# Altium schematic sheet Board.SchDoc
size 558 x 431 mm; SheetNumber: 1; SheetTotal: 3
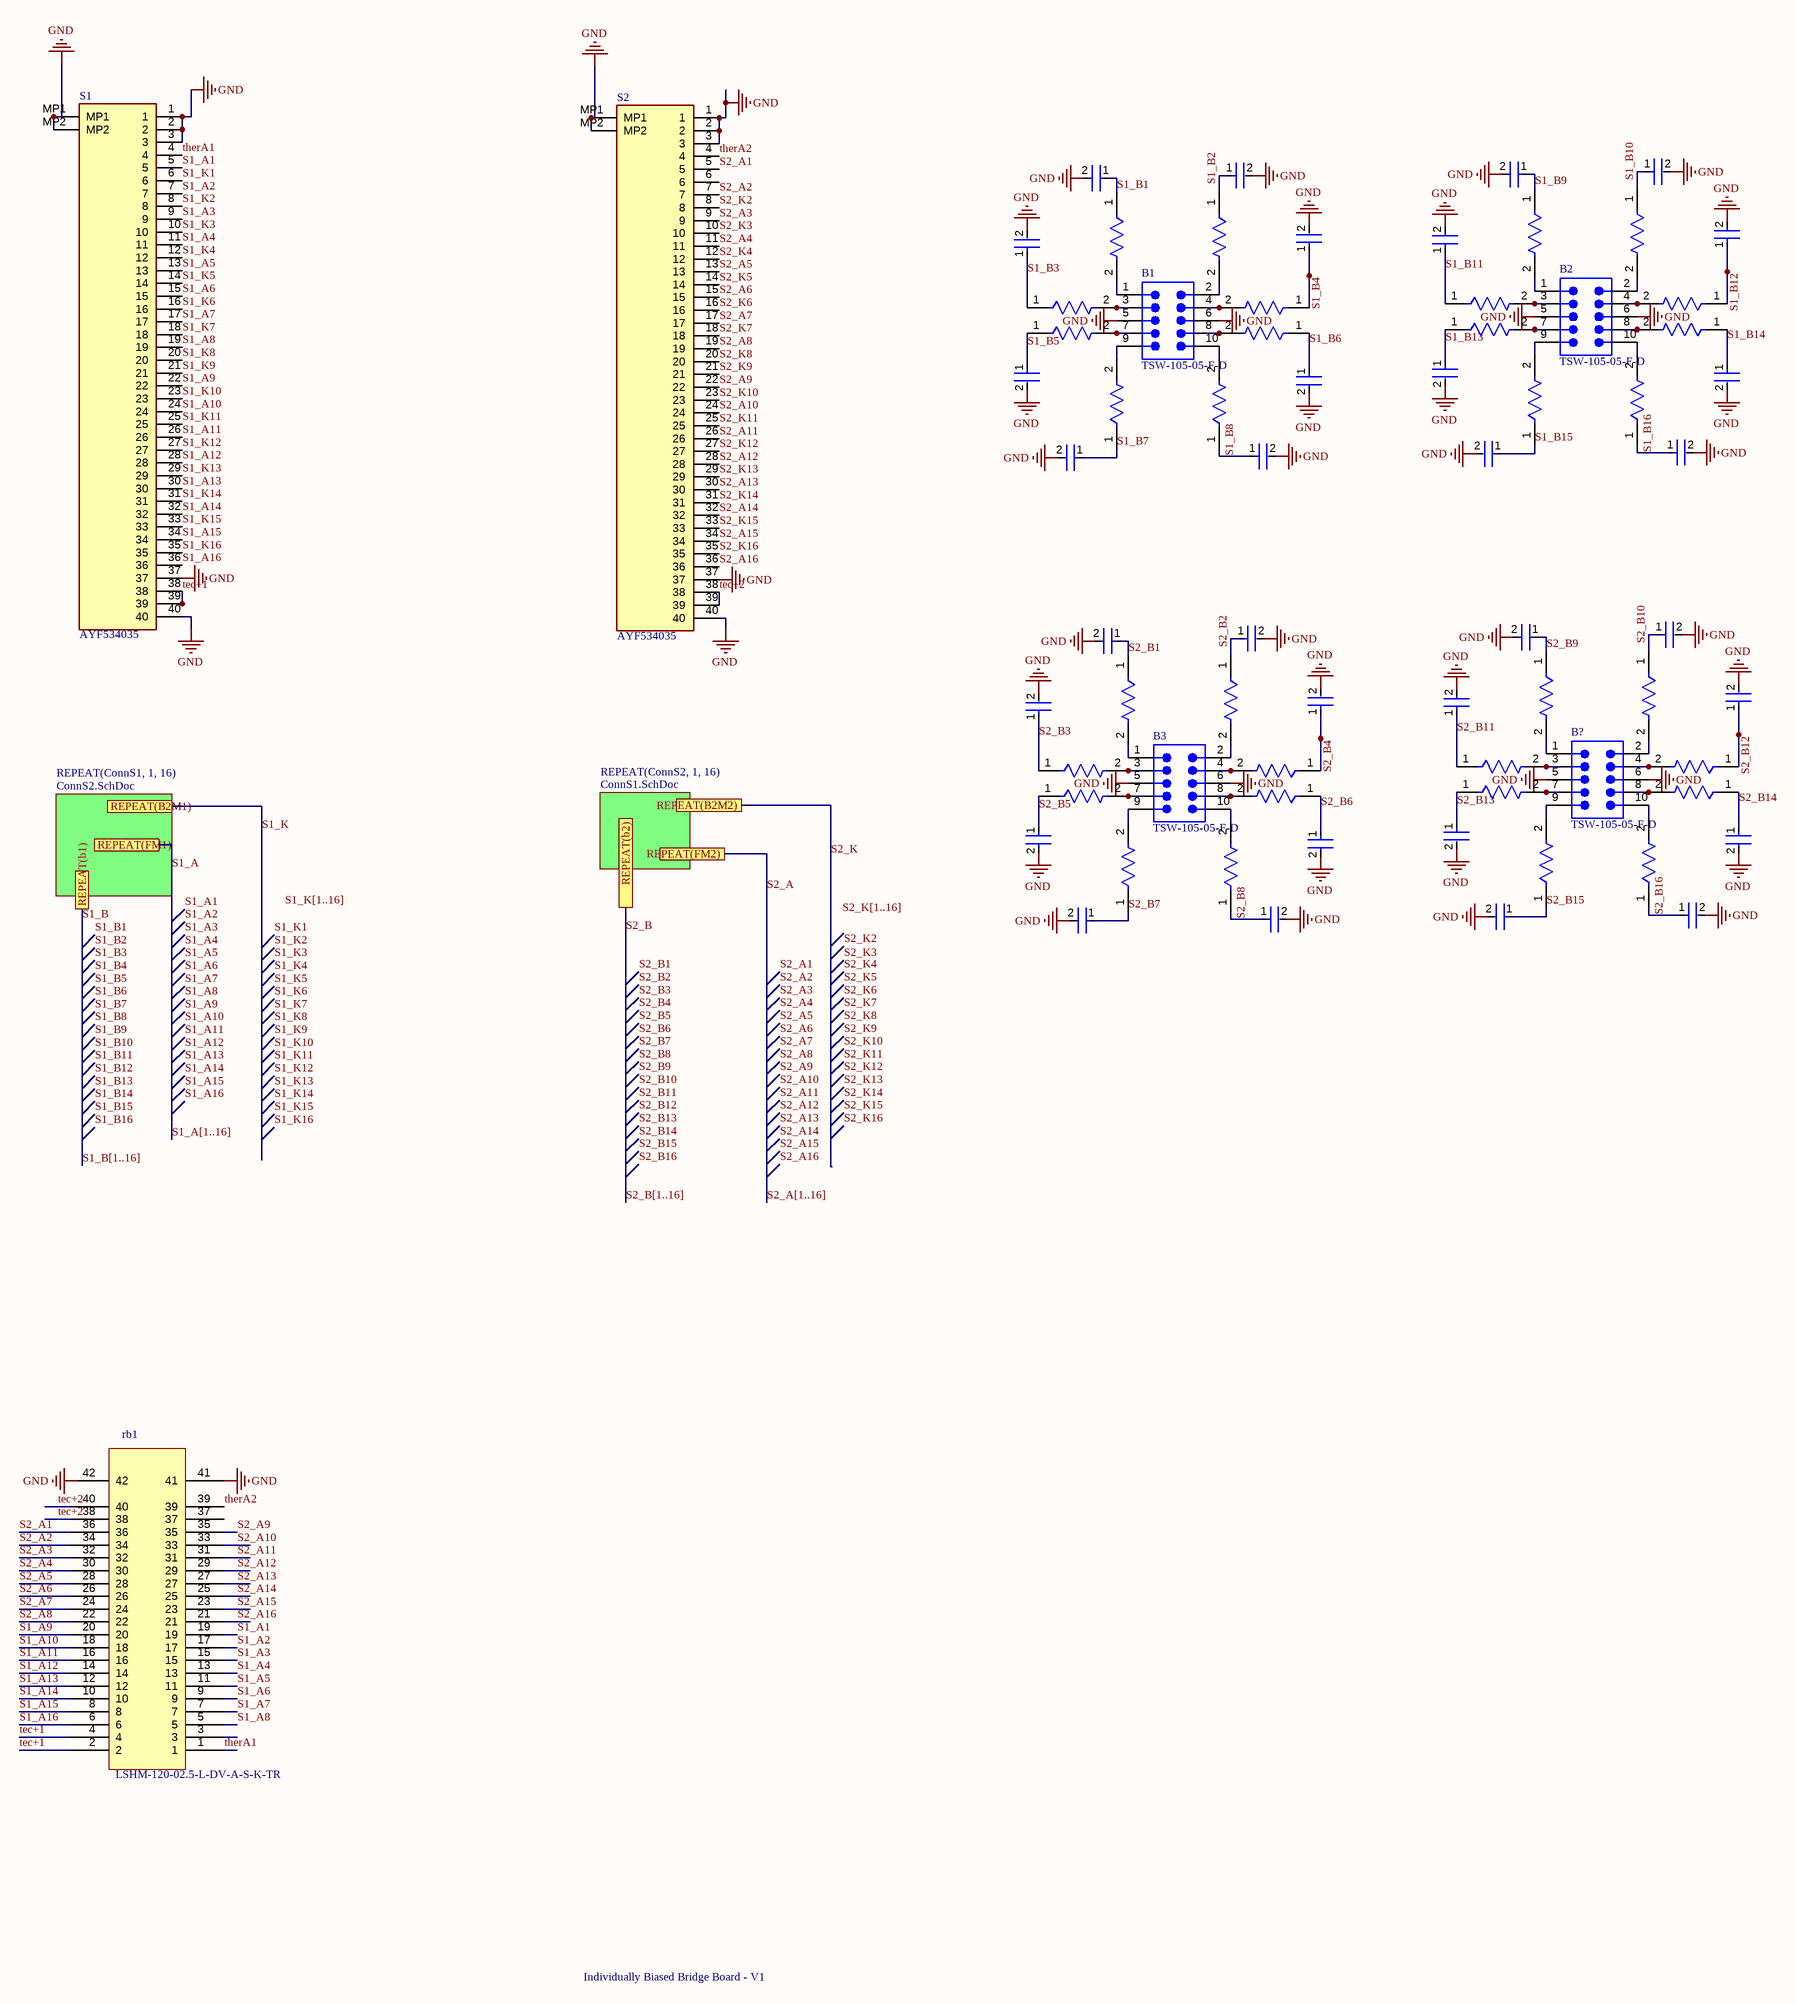
[diagram p0: Board.SchDoc]

## Parts
B1  TSW-105-05-F-D  [SMTC-TSW-105-05-X-D]
B2  TSW-105-05-F-D  [SMTC-TSW-105-05-X-D]
B3  TSW-105-05-F-D  [SMTC-TSW-105-05-X-D]
B?  TSW-105-05-F-D  [SMTC-TSW-105-05-X-D]
CT1  C0603C104K4RACTU  [FP-C0603C-CF-MFG]  (value not drawn)
CT2  C0603C104K4RACTU  [FP-C0603C-CF-MFG]  (value not drawn)
CT3  C0603C104K4RACTU  [FP-C0603C-CF-MFG]  (value not drawn)
CT4  C0603C104K4RACTU  [FP-C0603C-CF-MFG]  (value not drawn)
CT5  C0603C104K4RACTU  [FP-C0603C-CF-MFG]  (value not drawn)
CT6  C0603C104K4RACTU  [FP-C0603C-CF-MFG]  (value not drawn)
CT7  C0603C104K4RACTU  [FP-C0603C-CF-MFG]  (value not drawn)
CT8  C0603C104K4RACTU  [FP-C0603C-CF-MFG]  (value not drawn)
CT9  C0603C104K4RACTU  [FP-C0603C-CF-MFG]  (value not drawn)
CT10  C0603C104K4RACTU  [FP-C0603C-CF-MFG]  (value not drawn)
CT11  C0603C104K4RACTU  [FP-C0603C-CF-MFG]  (value not drawn)
CT12  C0603C104K4RACTU  [FP-C0603C-CF-MFG]  (value not drawn)
CT13  C0603C104K4RACTU  [FP-C0603C-CF-MFG]  (value not drawn)
CT14  C0603C104K4RACTU  [FP-C0603C-CF-MFG]  (value not drawn)
CT15  C0603C104K4RACTU  [FP-C0603C-CF-MFG]  (value not drawn)
CT16  C0603C104K4RACTU  [FP-C0603C-CF-MFG]  (value not drawn)
CT17  C0603C104K4RACTU  [FP-C0603C-CF-MFG]  (value not drawn)
CT18  C0603C104K4RACTU  [FP-C0603C-CF-MFG]  (value not drawn)
CT20  C0603C104K4RACTU  [FP-C0603C-CF-MFG]  (value not drawn)
CT21  C0603C104K4RACTU  [FP-C0603C-CF-MFG]  (value not drawn)
CT22  C0603C104K4RACTU  [FP-C0603C-CF-MFG]  (value not drawn)
CT23  C0603C104K4RACTU  [FP-C0603C-CF-MFG]  (value not drawn)
CT24  C0603C104K4RACTU  [FP-C0603C-CF-MFG]  (value not drawn)
CT25  C0603C104K4RACTU  [FP-C0603C-CF-MFG]  (value not drawn)
CT26  C0603C104K4RACTU  [FP-C0603C-CF-MFG]  (value not drawn)
CT27  C0603C104K4RACTU  [FP-C0603C-CF-MFG]  (value not drawn)
CT28  C0603C104K4RACTU  [FP-C0603C-CF-MFG]  (value not drawn)
CT29  C0603C104K4RACTU  [FP-C0603C-CF-MFG]  (value not drawn)
CT30  C0603C104K4RACTU  [FP-C0603C-CF-MFG]  (value not drawn)
CT31  C0603C104K4RACTU  [FP-C0603C-CF-MFG]  (value not drawn)
CT32  C0603C104K4RACTU  [FP-C0603C-CF-MFG]  (value not drawn)
CT33  C0603C104K4RACTU  [FP-C0603C-CF-MFG]  (value not drawn)
rb1  LSHM-120-02.5-L-DV-A-S-K-TR  [LSHM-120-02.5-L-DV-A-S-K-TR]
RP1  CR0402-FX-102GLF  [FP-CR0402-IPC_C]  (value not drawn)
RP2  CR0402-FX-102GLF  [FP-CR0402-IPC_C]  (value not drawn)
RP3  CR0402-FX-102GLF  [FP-CR0402-IPC_C]  (value not drawn)
RP4  CR0402-FX-102GLF  [FP-CR0402-IPC_C]  (value not drawn)
RP6  CR0402-FX-102GLF  [FP-CR0402-IPC_C]  (value not drawn)
RP7  CR0402-FX-102GLF  [FP-CR0402-IPC_C]  (value not drawn)
RP8  CR0402-FX-102GLF  [FP-CR0402-IPC_C]  (value not drawn)
RP9  CR0402-FX-102GLF  [FP-CR0402-IPC_C]  (value not drawn)
RS9  CR0402-FX-102GLF  [FP-CR0402-IPC_C]  (value not drawn)
RS10  CR0402-FX-102GLF  [FP-CR0402-IPC_C]  (value not drawn)
RS11  CR0402-FX-102GLF  [FP-CR0402-IPC_C]  (value not drawn)
RS12  CR0402-FX-102GLF  [FP-CR0402-IPC_C]  (value not drawn)
RS13  CR0402-FX-102GLF  [FP-CR0402-IPC_C]  (value not drawn)
RS14  CR0402-FX-102GLF  [FP-CR0402-IPC_C]  (value not drawn)
RS15  CR0402-FX-102GLF  [FP-CR0402-IPC_C]  (value not drawn)
RS16  CR0402-FX-102GLF  [FP-CR0402-IPC_C]  (value not drawn)
RS17  CR0402-FX-102GLF  [FP-CR0402-IPC_C]  (value not drawn)
RS18  CR0402-FX-102GLF  [FP-CR0402-IPC_C]  (value not drawn)
RS19  CR0402-FX-102GLF  [FP-CR0402-IPC_C]  (value not drawn)
RS20  CR0402-FX-102GLF  [FP-CR0402-IPC_C]  (value not drawn)
RS21  CR0402-FX-102GLF  [FP-CR0402-IPC_C]  (value not drawn)
RS22  CR0402-FX-102GLF  [FP-CR0402-IPC_C]  (value not drawn)
RS23  CR0402-FX-102GLF  [FP-CR0402-IPC_C]  (value not drawn)
RS24  CR0402-FX-102GLF  [FP-CR0402-IPC_C]  (value not drawn)
RS25  CR0402-FX-102GLF  [FP-CR0402-IPC_C]  (value not drawn)
RS26  CR0402-FX-102GLF  [FP-CR0402-IPC_C]  (value not drawn)
RS27  CR0402-FX-102GLF  [FP-CR0402-IPC_C]  (value not drawn)
RS28  CR0402-FX-102GLF  [FP-CR0402-IPC_C]  (value not drawn)
RS29  CR0402-FX-102GLF  [FP-CR0402-IPC_C]  (value not drawn)
RS30  CR0402-FX-102GLF  [FP-CR0402-IPC_C]  (value not drawn)
RS31  CR0402-FX-102GLF  [FP-CR0402-IPC_C]  (value not drawn)
RS35  CR0402-FX-102GLF  [FP-CR0402-IPC_C]  (value not drawn)
S1  AYF534035  [AYF534035]
S2  AYF534035  [AYF534035]

## Sub-sheets
REPEAT(ConnS1, 1, 16) = ConnS2.SchDoc: no entries
REPEAT(ConnS2, 1, 16) = ConnS1.SchDoc: no entries

## Ports
REPEAT(b1), REPEAT(b2), REPEAT(B2M1), REPEAT(B2M2), REPEAT(FM1), REPEAT(FM2)

## Nets
GND: B1.5 B1.6 B2.5 B2.6 B3.5 B3.6 B?.5 B?.6 CT1.2 CT2.2 CT3.2 CT4.2 CT5.2 CT6.2 CT7.2 CT8.2 CT9.2 CT10.2 CT11.2 CT12.2 CT13.2 CT14.2 CT15.2 CT16.2 CT17.2 CT18.2 CT20.2 CT21.2 CT22.2 CT23.2 CT24.2 CT25.2 CT26.2 CT27.2 CT28.2 CT29.2 CT30.2 CT31.2 CT32.2 CT33.2 rb1.41 S1.1 S1.2 S1.3 S1.37 S1.40 S1.MP1 S1.MP2 S2.1 S2.2 S2.3 S2.37 S2.40 S2.MP1 S2.MP2
S1_A: port REPEAT(FM1)
S1_A1: rb1.19 S1.5
S1_A2: rb1.17 S1.7
S1_A3: rb1.15 S1.9
S1_A4: rb1.13 S1.11
S1_A5: rb1.11 S1.13
S1_A6: rb1.9 S1.15
S1_A7: rb1.7 S1.17
S1_A8: rb1.5 S1.19
S1_A9: rb1.20 S1.22
S1_A10: rb1.18 S1.24
S1_A11: rb1.16 S1.26
S1_A12: rb1.14 S1.28
S1_A13: rb1.12 S1.30
S1_A14: rb1.10 S1.32
S1_A15: rb1.8 S1.34
S1_A16: rb1.6 S1.36
S1_B: port REPEAT(b1)
S1_B1: CT1.1 RP1.1
S1_B2: CT2.1 RP2.1
S1_B3: CT8.1 RP9.1
S1_B4: CT3.1 RP3.1
S1_B5: CT7.1 RP8.1
S1_B6: CT4.1 RP4.1
S1_B7: CT6.1 RP7.1
S1_B8: CT5.1 RP6.1
S1_B9: CT9.1 RS9.1
S1_B10: CT10.1 RS10.1
S1_B11: CT16.1 RS16.1
S1_B12: CT11.1 RS11.1
S1_B13: CT15.1 RS15.1
S1_B14: CT12.1 RS12.1
S1_B15: CT14.1 RS14.1
S1_B16: CT13.1 RS13.1
S1_K: port REPEAT(B2M1)
S1_K1: S1.6
S1_K2: S1.8
S1_K3: S1.10
S1_K4: S1.12
S1_K5: S1.14
S1_K6: S1.16
S1_K7: S1.18
S1_K8: S1.20
S1_K9: S1.21
S1_K10: S1.23
S1_K11: S1.25
S1_K12: S1.27
S1_K13: S1.29
S1_K14: S1.31
S1_K15: S1.33
S1_K16: S1.35
S2_A: port REPEAT(FM2)
S2_A1: rb1.36 S2.5
S2_A2: rb1.34 S2.7
S2_A3: rb1.32 S2.9
S2_A4: rb1.30 S2.11
S2_A5: rb1.28 S2.13
S2_A6: rb1.26 S2.15
S2_A7: rb1.24 S2.17
S2_A8: rb1.22 S2.19
S2_A9: rb1.35 S2.22
S2_A10: rb1.33 S2.24
S2_A11: rb1.31 S2.26
S2_A12: rb1.29 S2.28
S2_A13: rb1.27 S2.30
S2_A14: rb1.25 S2.32
S2_A15: rb1.23 S2.34
S2_A16: rb1.21 S2.36
S2_B: port REPEAT(b2)
S2_B1: CT17.1 RS17.1
S2_B2: CT18.1 RS18.1
S2_B3: CT25.1 RS24.1
S2_B4: CT20.1 RS19.1
S2_B5: CT24.1 RS23.1
S2_B6: CT21.1 RS20.1
S2_B7: CT23.1 RS22.1
S2_B8: CT22.1 RS21.1
S2_B9: CT26.1 RS25.1
S2_B10: CT27.1 RS26.1
S2_B11: CT33.1 RS31.1
S2_B12: CT28.1 RS27.1
S2_B13: CT32.1 RS30.1
S2_B14: CT29.1 RS35.1
S2_B15: CT31.1 RS29.1
S2_B16: CT30.1 RS28.1
S2_K: port REPEAT(B2M2)
S2_K2: S2.8
S2_K3: S2.10
S2_K4: S2.12
S2_K5: S2.14
S2_K6: S2.16
S2_K7: S2.18
S2_K8: S2.20
S2_K9: S2.21
S2_K10: S2.23
S2_K11: S2.25
S2_K12: S2.27
S2_K13: S2.29
S2_K14: S2.31
S2_K15: S2.33
S2_K16: S2.35
tec+1: rb1.2 rb1.4 S1.38 S1.39
tec+2: rb1.38 rb1.40 S2.38 S2.39
therA1: rb1.1 S1.4
therA2: rb1.39 S2.4
NetB1_1: B1.1 RP1.2
NetB1_2: B1.2 RP2.2
NetB1_3: B1.3 RP9.2
NetB1_4: B1.4 RP3.2
NetB1_7: B1.7 RP8.2
NetB1_8: B1.8 RP4.2
NetB1_9: B1.9 RP7.2
NetB1_10: B1.10 RP6.2
NetB2_1: B2.1 RS9.2
NetB2_2: B2.2 RS10.2
NetB2_3: B2.3 RS16.2
NetB2_4: B2.4 RS11.2
NetB2_7: B2.7 RS15.2
NetB2_8: B2.8 RS12.2
NetB2_9: B2.9 RS14.2
NetB2_10: B2.10 RS13.2
NetB3_1: B3.1 RS17.2
NetB3_2: B3.2 RS18.2
NetB3_3: B3.3 RS24.2
NetB3_4: B3.4 RS19.2
NetB3_7: B3.7 RS23.2
NetB3_8: B3.8 RS20.2
NetB3_9: B3.9 RS22.2
NetB3_10: B3.10 RS21.2
NetB?_1: B?.1 RS25.2
NetB?_2: B?.2 RS26.2
NetB?_3: B?.3 RS31.2
NetB?_4: B?.4 RS27.2
NetB?_7: B?.7 RS30.2
NetB?_8: B?.8 RS35.2
NetB?_9: B?.9 RS29.2
NetB?_10: B?.10 RS28.2

Not connected (* = marked no-connect by the designer): rb1 3 37 42; S2 6

## Buses and harness runs
bus S1_A[1..16]
bus S1_B[1..16]
bus S1_K[1..16]
bus S2_A[1..16]
bus S2_B[1..16]
bus S2_K[1..16]

## Notes on the sheet
- Individually Biased Bridge Board - V1
- Labels drawn without touching a wire or pin: GND, S1_A1, S1_A2, S1_A3, S1_A4, S1_A5, S1_A6, S1_A7, S1_A8, S1_A9, S1_A10, S1_A11, S1_A12, S1_A13, S1_A14, S1_A15, S1_A16, S1_B1, S1_B2, S1_B3, S1_B4, S1_B5, S1_B6, S1_B7, S1_B8, S1_B9, S1_B10, S1_B11, S1_B12, S1_B13, S1_B14, S1_B15, S1_B16, S1_K1, S1_K2, S1_K3, S1_K4, S1_K5, S1_K6, S1_K7, S1_K8, S1_K9, S1_K10, S1_K11, S1_K12, S1_K13, S1_K14, S1_K15, S1_K16, S1_K[1..16], S2_A1, S2_A2, S2_A3, S2_A4, S2_A5, S2_A6, S2_A7, S2_A8, S2_A9, S2_A10, S2_A11, S2_A12, S2_A13, S2_A14, S2_A15, S2_A16, S2_B1, S2_B2, S2_B3, S2_B4, S2_B5, S2_B6, S2_B7, S2_B8, S2_B9, S2_B10, S2_B11, S2_B12, S2_B13, S2_B14, S2_B15, S2_B16, S2_K2, S2_K3, S2_K4, S2_K5, S2_K6, S2_K7, S2_K8, S2_K9, S2_K10, S2_K11, S2_K12, S2_K13, S2_K14, S2_K15, S2_K16, S2_K[1..16]
- DWG. NO.
- REV.
- SHT.
- REVISION
- DESCRIPTION
- DATE
- APPROVED
- THIS DOCUMENT AND THE DATA DISCLOSED HEREIN OR HEREWITH IS THE PROPERTY OF ALTIUM LIMITED AND MAY BE FREELY DISTRIBUTED IN WHOLE. NO RIGHTS ARE RESERVED OR EXPRESS OR IMPLIED WARANTEE GIVEN.
- ENG:
- DSN:
- APPROVALS
- PROJECT
- DOCUMENT REVISION:
- DESIGN ITEM:
- CHK:
- BOM:
- REFERENCE DOCUMENTS
- PROJECT REVISION:
- TITLE
- FAB DWG:
- PCB DWG:
- ASSY DWG:
- SCALE:
- SIZE
- C
- CAGE CODE
- FILE NAME
- DWG NO.
- SHEET
- OF
- REV

## Library data of the parts
B1-B3 B? = CMP-1024-00360-1: 0.025" SQ Post Header, Through-hole, Vertical, -55 to 125 degC, 2.54 mm Pitch, 10-Pin, Male, RoHS; Manufacturer: Samtec; Pitch: 2.54 mm; PackageReference: TSW-105-05-X-D; PackageVersion: DM, 8/1988; ComponentLink3URL: http://www.samtec.com/documents/webfiles/cpdf/TSW-XXX-XX-XXX-X-XX-XXX-MKT.pdf; Mounting Technology: Through-hole; ComponentLink3Description: Package Specification; PackageDescription: .025[0.64] SQ. Post Terminal Strip Assembly; ComponentLink1URL: http://www.samtec.com; ComponentLink1Description: Manufacturer URL; ComponentLink2Description: Datasheet; PartNumber: TSW-105-05-F-D; ComponentLink2URL: http://www.samtec.com/documents/webfiles/pdf/TSW_TH.PDF; RoHS: True; Temperature Range: -55 to 125 degC; DatasheetVersion: F-214; Orientation: Vertical
CT1-CT18 CT20-CT33 = CMP-2006-03811-3: Manufacturer: KEMET; Value: 0.10 μF; Voltage Rating: 16 V; Temperature Coefficient: 30ppm/°C; Temperature Characteristic: X7R; Automotive Grade: Grade 1; Tolerance: 0.1; Digikey Description: Capacitor; Ceramic; Cap; .100uF; Tol 10%; SMT; Vol-Rtg 16V; X7R; Tape and Reel; Automotive: Yes; Temperature Range High: +125°C; Device Class L1: Passive Components; Material: Ceramic; Lead Free: Yes; Device Class L2: Capacitors; Capacitance: 0.10 μF; Height: 0.87mm; Manufacturer Part Number: C0603C104K4RACTU; Octopart: https://octopart.com/c0603c104k4ractu-kemet-93067; Package: C0603C-CF; Device Class L3: Ceramic Capacitors; ComponentLink2URL: https://api.kemet.com/component-edge/download/datasheet/C0603C100J5GACAUTO.pdf; Temperature Range Low: -55°C; ComponentLink2Description: Datasheet; Mouser Description: Multilayer Ceramic Capacitors MLCC - SMD/SMT 16volts 0.1uF 10% X7R 10%; RoHS: TRUE; Temperature: -55°C to +125°C; Category: Cap
rb1 = LSHM-120-02.5-L-DV-A-S-K-TR: razor beam 40
RP1-RP4 RP6-RP9 RS9-RS31 RS35 = CMP-2002-04703-2: Thick Film Chip Resistors 0402 1kΩ 0.0625W 1% 100ppm/°C; Voltage Rating: 50V; Max Power Dissipation: 63mW; Resistance: 1kR; Power Rating: 62.5mW; Package Quantity: 10000; Radiation Hardening: No; Temperature Coefficient: 100ppm/°C; Number of Terminations: 2; Packaging: Tape and Reel; Thickness: 356um; Case Code (Metric): 1005; Case/Package: 0402; Case Code (Imperial): 0402; Max Operating Temperature: 155°C; Composition: Thick Film; Min Operating Temperature: -55°C; Mount: Surface Mount; Tolerance: 1%; Termination: SMD/SMT; Width: 0.02inch; Contact Plating: Tin; Height: 0.016inch; Length: 0.039inch